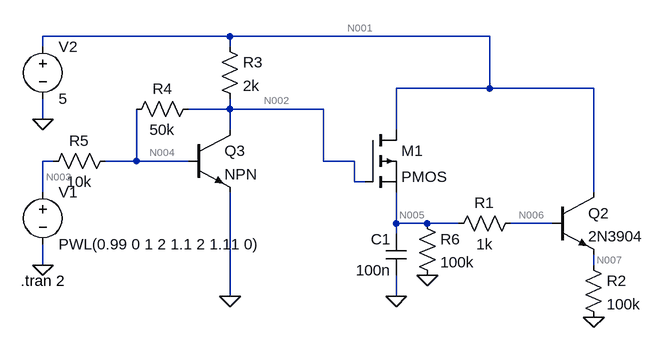
[diagram p0: schematic Draft1.asc]
Draft1.asc, the LTspice schematic file:
Version 4
SHEET 1 956 680
WIRE 320 -96 32 -96
WIRE 720 -96 320 -96
WIRE 32 -80 32 -96
WIRE 320 -80 320 -96
WIRE 720 -16 720 -96
WIRE 720 -16 576 -16
WIRE 880 -16 720 -16
WIRE 320 16 320 0
WIRE 320 16 256 16
WIRE 464 16 320 16
WIRE 32 32 32 0
WIRE 320 48 320 16
WIRE 576 48 576 -16
WIRE 48 96 32 96
WIRE 176 96 176 16
WIRE 176 96 128 96
WIRE 256 96 176 96
WIRE 464 96 464 16
WIRE 512 96 464 96
WIRE 512 128 512 96
WIRE 528 128 512 128
WIRE 32 144 32 96
WIRE 880 144 880 -16
WIRE 576 192 576 144
WIRE 624 192 576 192
WIRE 672 192 624 192
WIRE 816 192 752 192
WIRE 576 208 576 192
WIRE 32 256 32 224
WIRE 880 256 880 240
WIRE 320 304 320 144
WIRE 576 304 576 272
FLAG 32 256 0
FLAG 576 304 0
FLAG 32 32 0
FLAG 880 336 0
FLAG 320 304 0
FLAG 624 272 0
SYMBOL voltage 32 128 R0
WINDOW 123 0 0 Left 0
WINDOW 39 0 0 Left 0
SYMATTR InstName V1
SYMATTR Value PWL(0.99 0 1 2 1.1 2 1.11 0)
SYMBOL res 656 208 R270
WINDOW 0 32 56 VTop 2
WINDOW 3 0 56 VBottom 2
SYMATTR InstName R1
SYMATTR Value 1k
SYMBOL cap 592 272 R180
WINDOW 0 24 56 Left 2
WINDOW 3 24 8 Left 2
SYMATTR InstName C1
SYMATTR Value 100n
SYMBOL voltage 32 -96 R0
WINDOW 123 0 0 Left 0
WINDOW 39 0 0 Left 0
SYMATTR InstName V2
SYMATTR Value 5
SYMBOL npn 816 144 R0
SYMATTR InstName Q2
SYMATTR Value 2N3904
SYMBOL res 864 240 R0
SYMATTR InstName R2
SYMATTR Value 100k
SYMBOL npn 256 48 R0
SYMATTR InstName Q3
SYMBOL res 304 -96 R0
SYMATTR InstName R3
SYMATTR Value 2k
SYMBOL res 272 0 R90
WINDOW 0 0 56 VBottom 2
WINDOW 3 32 56 VTop 2
SYMATTR InstName R4
SYMATTR Value 50k
SYMBOL res 144 80 R90
WINDOW 0 0 56 VBottom 2
WINDOW 3 32 56 VTop 2
SYMATTR InstName R5
SYMATTR Value 10k
SYMBOL res 608 176 R0
SYMATTR InstName R6
SYMATTR Value 100k
SYMBOL pmos 528 48 R0
SYMATTR InstName M1
TEXT -2 280 Left 2 !.tran 2

The netlist it stands for:
* Draft1.asc
V1 N003 0 PWL(0.99 0 1 2 1.1 2 1.11 0)
R1 N005 N006 1k
C1 0 N005 100n
V2 N001 0 5
Q2 N001 N006 N007 0 2N3904
R2 N007 0 100k
Q3 N002 N004 0 0 NPN
R3 N001 N002 2k
R4 N002 N004 50k
R5 N004 N003 10k
R6 N005 0 100k
M1 N001 N002 N005 N005 PMOS
.model NPN NPN
.model PNP PNP
.lib standard.bjt
.model NMOS NMOS
.model PMOS PMOS
.lib standard.mos
.tran 2
.backanno
.end

* Results of the author's LTspice run, read from the files saved beside the schematic
* Operating Point, zero values left out:
*   V(n005) = 2.799 V
*   V(n006) = 2.798 V
*   V(n001) = 5 V
*   V(n007) = 2.124 V
*   V(n002) = 4.478 V
*   V(n004) = 730.8 mV
*   Ic(Q3) = 186.2 µA
*   Ib(Q3) = 1.862 µA
*   Ie(Q3) = -188.1 µA
*   Ic(Q2) = 21.03 µA
*   Ib(Q2) = 210.3 nA
*   Ie(Q2) = -21.24 µA
*   Id(M1) = 28.2 µA
*   Ib(M1) = -2.211 pA
*   Is(M1) = -28.2 µA
*   I(R6) = 27.99 µA
*   I(R5) = 73.08 µA
*   I(R4) = 74.94 µA
*   I(R3) = 261.2 µA
*   I(R2) = 21.24 µA
*   I(R1) = 210.3 nA
*   I(V2) = -310.4 µA
*   I(V1) = 73.08 µA
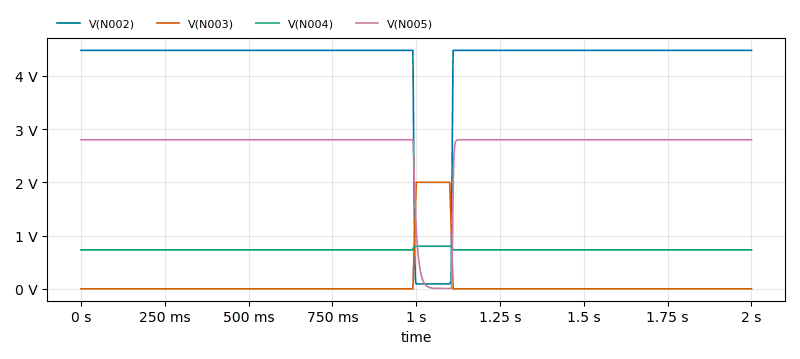
[diagram p1: Transient Analysis of Draft1.asc, plotted from the saved traces]
* Transient Analysis, 1 run:
*   V(N002): min 90.38 mV, max 4.478 V, average 4.228 V, rms 4.346 V, last 4.478 V
*   V(N003): min 0 V, max 2 V, average 110 mV, rms 462 mV, last 0 V
*   V(N004): min 730.8 mV, max 799.2 mV, average 734.7 mV, rms 734.9 mV, last 730.8 mV
*   V(N005): min 6.984 mV, max 2.799 V, average 2.647 V, rms 2.717 V, last 2.799 V